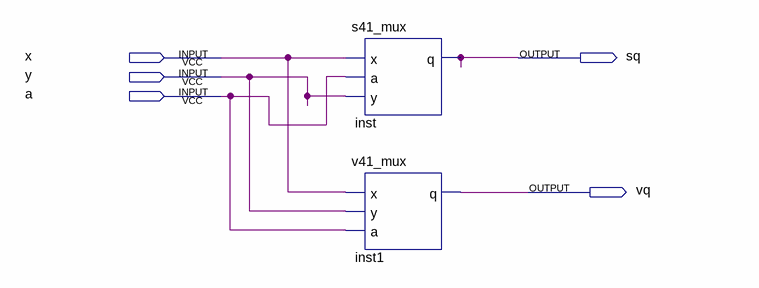
[diagram p0: schematic sheet]
// Quartus schematic sv41_mux.bdf as structural Verilog: 2 symbols, 5 pins
module sv41_mux (
  input  x,
  input  y,
  input  a,
  output sq,
  output vq
);

  s41_mux inst (.x(x), .a(a), .y(y), .q(sq));
  v41_mux inst1 (.x(x), .y(y), .a(a), .q(vq));
endmodule
